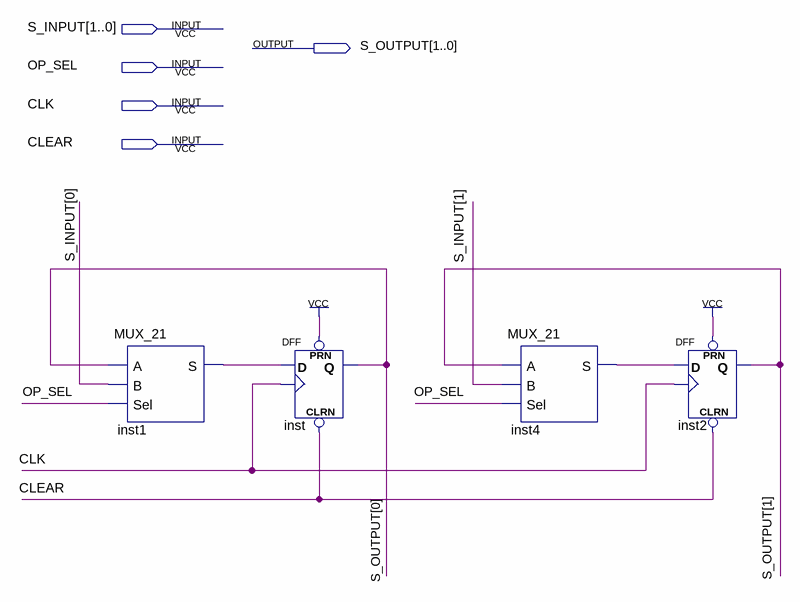
[diagram p0: schematic sheet]
// Quartus schematic STATE_REGISTER.bdf as structural Verilog: 4 symbols, 5 pins
module STATE_REGISTER (
  input  [1:0] S_INPUT,
  input  OP_SEL,
  input  CLK,
  input  CLEAR,
  output [1:0] S_OUTPUT
);

  wire inst1_s, inst4_s;

  MUX_21 inst1 (.A(S_OUTPUT[0]), .B(S_INPUT[0]), .Sel(OP_SEL), .S(inst1_s));
  DFF inst (.CLRN(CLEAR), .CLK(CLK), .D(inst1_s), .PRN(1'b1), .Q(S_OUTPUT[0]));
  MUX_21 inst4 (.A(S_OUTPUT[1]), .B(S_INPUT[1]), .Sel(OP_SEL), .S(inst4_s));
  DFF inst2 (.CLRN(CLEAR), .CLK(CLK), .D(inst4_s), .PRN(1'b1), .Q(S_OUTPUT[1]));
endmodule
